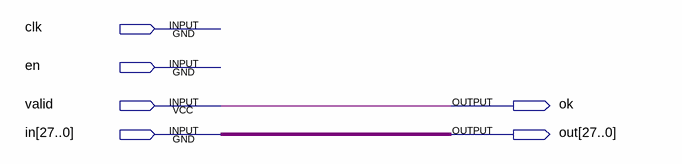
[diagram p0: schematic sheet]
// Quartus schematic noise_blanker.bdf as structural Verilog: 0 symbols, 6 pins
module noise_blanker (
  input  clk,
  input  en,
  input  valid,
  input  [27:0] in,
  output ok,
  output [27:0] out
);


  assign ok = valid;
  assign out = in;
endmodule
